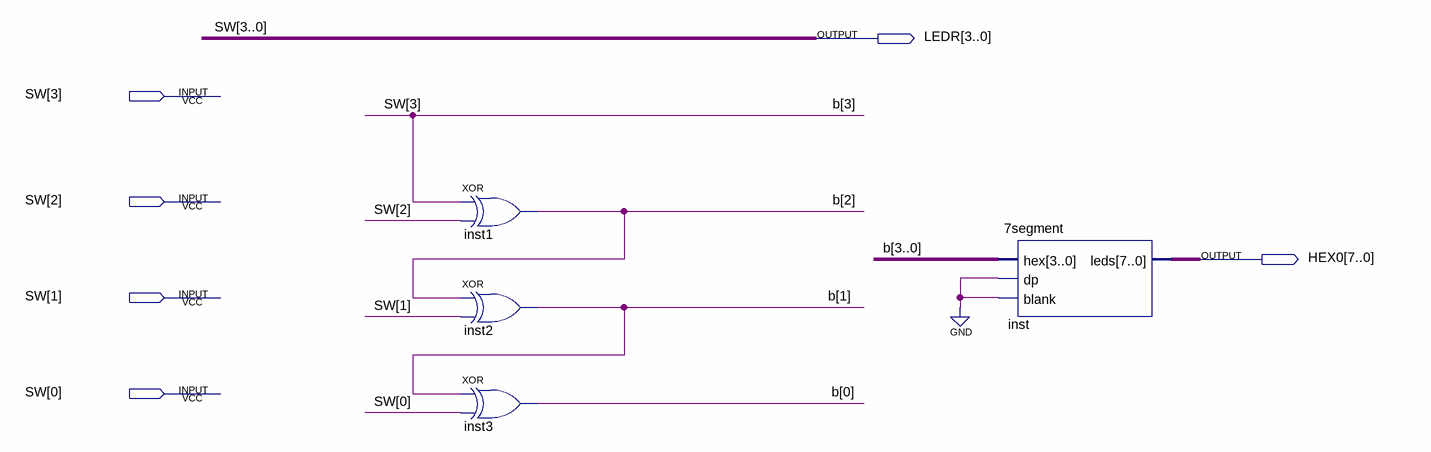
[diagram p0: schematic sheet]
// Quartus schematic LEDtest.bdf as structural Verilog: 4 symbols, 6 pins
module LEDtest (
  input  [3:0] SW,
  output [3:0] LEDR,
  output [7:0] HEX0
);

  wire [2:0] b;

  xor inst1 (b[2], SW[3], SW[2]);
  xor inst2 (b[1], b[2], SW[1]);
  xor inst3 (b[0], b[1], SW[0]);
  \7segment  inst (.hex({SW[3], b}), .dp(1'b0), .blank(1'b0), .leds(HEX0));

  assign LEDR = SW;

  // Other names for the same wires on the sheet: b[3] = SW[3]
endmodule
